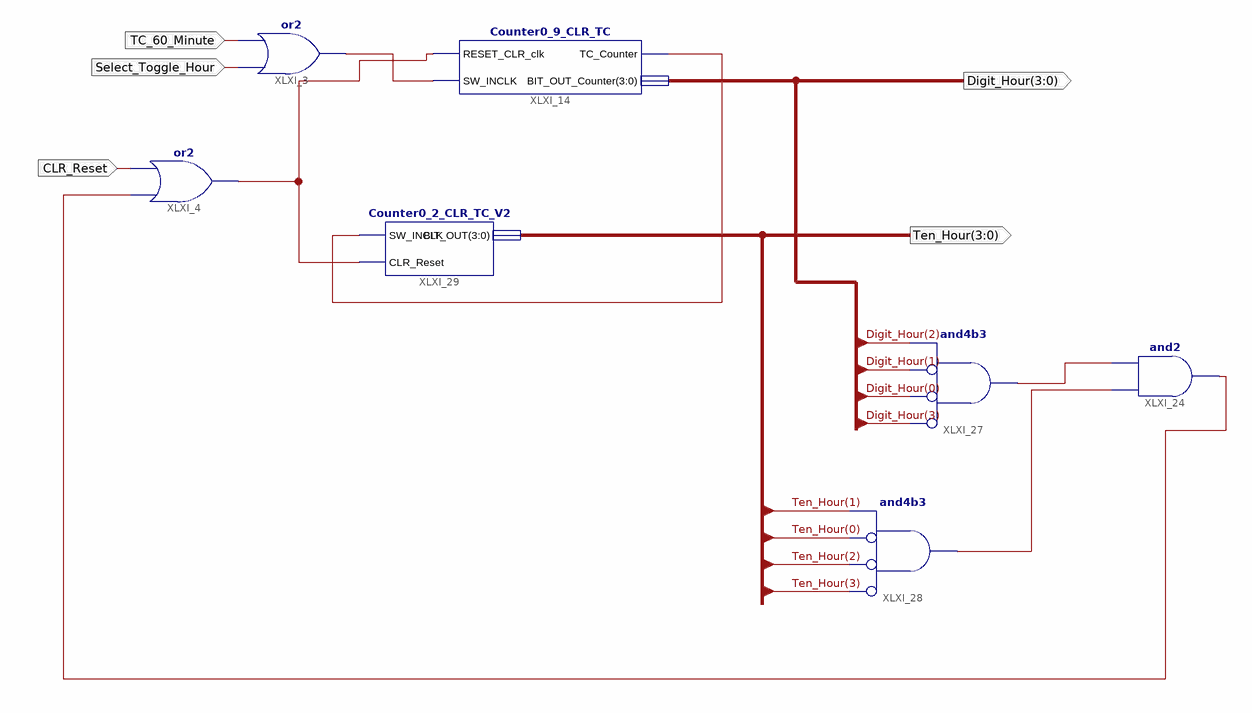
[diagram p0: schematic sheet 1]
// Xilinx ISE schematic Time_23_Hour.sch (spartan6) as structural Verilog: 7 symbols, 5 ports
module Time_23_Hour (
  input  TC_60_Minute,
  input  Select_Toggle_Hour,
  input  CLR_Reset,
  output [3:0] Ten_Hour,
  output [3:0] Digit_Hour
);

  wire XLXN_9, XLXN_26, XLXN_37, XLXN_60, XLXN_103, XLXN_108;

  or XLXI_3 (XLXN_9, Select_Toggle_Hour, TC_60_Minute);
  or XLXI_4 (XLXN_26, XLXN_60, CLR_Reset);
  Counter0_9_CLR_TC XLXI_14 (
    .BIT_OUT_Counter(Digit_Hour), .RESET_CLR_clk(XLXN_26), .SW_INCLK(XLXN_9), .TC_Counter(XLXN_37));
  and XLXI_24 (XLXN_60, XLXN_108, XLXN_103);
  and XLXI_27 (XLXN_103, ~Digit_Hour[3], ~Digit_Hour[0], ~Digit_Hour[1], Digit_Hour[2]);  // and4b3
  and XLXI_28 (XLXN_108, ~Ten_Hour[3], ~Ten_Hour[2], ~Ten_Hour[0], Ten_Hour[1]);  // and4b3
  Counter0_2_CLR_TC_V2 XLXI_29 (.BIT_OUT(Ten_Hour), .CLR_Reset(XLXN_26), .SW_INCLK(XLXN_37));
endmodule
